# Altium schematic sheet 05 AM572x SYSTEM.SchDoc
size 420 x 297 mm
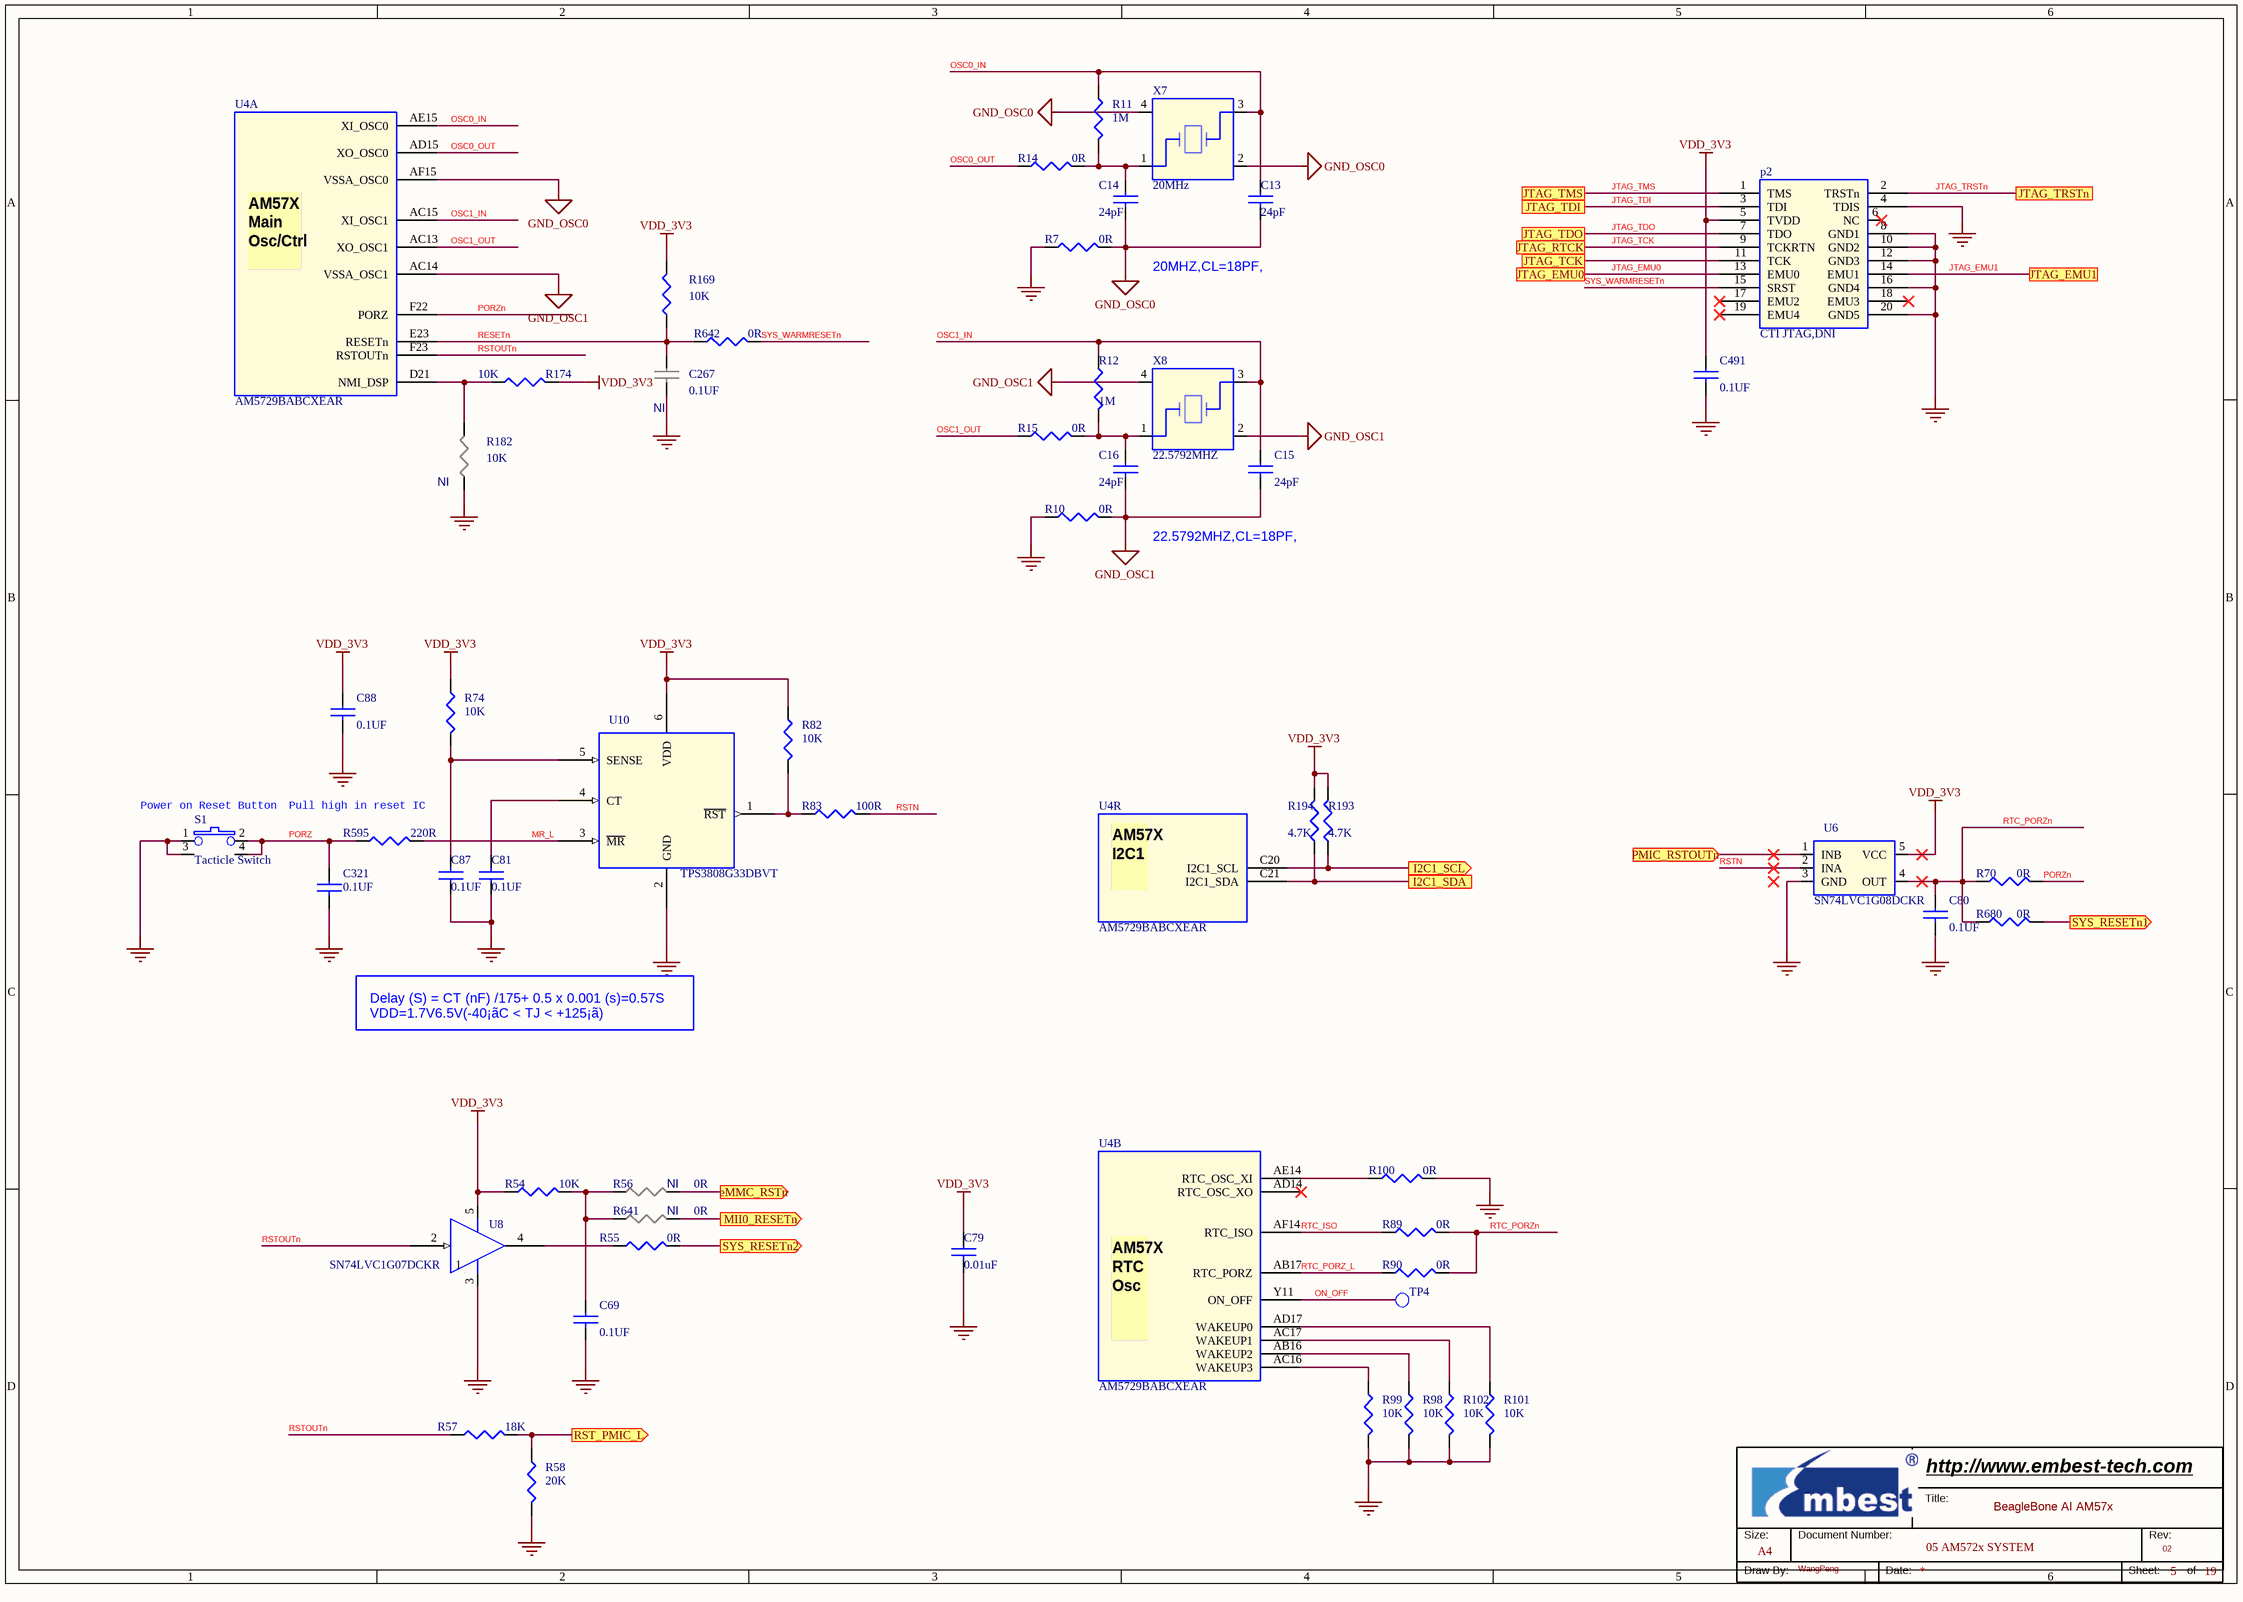
[diagram p0: 05 AM572x SYSTEM.SchDoc]

## Parts
*  Page Count: 19  Page Number: 5  Page Size: A4  Title: BeagleBone AI AM57x  RevCode: 02  Doc: 05 AM572x SYSTEM  Drawing: WangPeng  (hidden comment: Embest Title)  (graphical)
C13  24pF  [C0402]
C14  24pF  [C0402]
C15  24pF  [C0402]
C16  24pF  [C0402]
C69  0.1UF  [C0402]
C79  0.01uF  [C0402]
C80  0.1UF  [C0402]
C81  0.1UF  [C0402]
C87  0.1UF  [C0402]
C88  0.1UF  [C0402]
C267  0.1UF  ASSY: NI  [C0402]
C321  0.1UF  [C0402]
C491  0.1UF  [C0402]
p2  CTI JTAG,DNI  [header10x2]
R7  0R  [R0402]
R10  0R  [R0402]
R11  1M  [R0402]
R12  1M  [R0402]
R14  0R  [R0402]
R15  0R  [R0402]
R54  10K  [R0402]
R55  0R  [R0402]
R56  0R  ASSY: NI  [R0402]
R57  18K  [R0402]
R58  20K  [R0402]
R70  0R  [R0402]
R74  10K  [R0402]
R82  10K  [R0402]
R83  100R  [R0402]
R89  0R  [R0402]
R90  0R  [R0402]
R98  10K  [R0402]
R99  10K  [R0402]
R100  0R  [R0402]
R101  10K  [R0402]
R102  10K  [R0402]
R169  10K  [R0402]
R174  10K  [R0402]
R182  10K  ASSY: NI  [R0402]
R193  4.7K  [R0402]
R194  4.7K  [R0402]
R595  220R  [R0402]
R641  0R  ASSY: NI  [R0402]
R642  0R  [R0402]
R680  0R  [R0402]
S1  Tacticle Switch  [SWS4B46X28]
TP4  NI  [TP1-8040]  (value not drawn)
U4  AM5729BABCXEAR  [BGA23X23-760-117M]  (parts A,B,R of 29)
U6  SN74LVC1G08DCKR  [SC70_5]
U8  SN74LVC1G07DCKR  [SC70_5]
U10  TPS3808G33DBVT  [SOT23_6]
X7  20MHz  [OSCCC250x200x60-4N]
X8  22.5792MHZ  [OSCCC250x200x60-4N]

## Ports
eMMC_RSTn (out), I2C1_SCL (out), I2C1_SDA, JTAG_EMU0, JTAG_EMU1, JTAG_RTCK, JTAG_TCK, JTAG_TDI, JTAG_TDO, JTAG_TMS, JTAG_TRSTn, MII0_RESETn (out), PMIC_RSTOUTn (in), RST_PMIC_L (out), SYS_RESETn1 (out), SYS_RESETn2 (out)

## Nets
GND: C69.2 C79.2 C80.2 C81.1 C87.1 C88.2 C267.2 C321.2 C491.2 p2.4(TDIS) p2.8(GND1) p2.10(GND2) p2.12(GND3) p2.16(GND4) p2.20(GND5) R7.1 R10.1 R58.2 R98.2 R99.2 R100.2 R101.2 R102.2 R182.1 S1.1 S1.3 U6.3(GND) U8.3(GND) U10.2(GND)
GND_OSC0: C13.2 C14.2 R7.2 U4.AF15(VSSA_OSC0) X7.2 X7.4
GND_OSC1: C15.2 C16.2 R10.2 U4.AC14(VSSA_OSC1) X8.2 X8.4
VDD_3V3: C79.1 C88.1 C491.1 p2.5(TVDD) R54.1 R74.1 R82.1 R169.2 R174.2 R193.2 R194.2 U6.5(VCC) U8.5(VCC) U10.6(VDD)
eMMC_RSTn: R56.1 ; port eMMC_RSTn
I2C1_SCL: R193.1 U4.C20(I2C1_SCL) ; port I2C1_SCL
I2C1_SDA: R194.1 U4.C21(I2C1_SDA) ; port I2C1_SDA
JTAG_EMU0: p2.13(EMU0) ; port JTAG_EMU0
JTAG_EMU1: p2.14(EMU1) ; port JTAG_EMU1
JTAG_TCK: p2.9(TCKRTN) ; port JTAG_RTCK
JTAG_TCK: p2.11(TCK) ; port JTAG_TCK  [a separate net that carries the same name]
JTAG_TDI: p2.3(TDI) ; port JTAG_TDI
JTAG_TDO: p2.7(TDO) ; port JTAG_TDO
JTAG_TMS: p2.1(TMS) ; port JTAG_TMS
JTAG_TRSTn: p2.2(TRSTn) ; port JTAG_TRSTn
MII0_RESETn: R641.1 ; port MII0_RESETn
MR_L: R595.2 U10.3(~{MR})
ON_OFF: TP4.1(TP) U4.Y11(ON_OFF)
OSC0_IN: C13.1 R11.1 U4.AE15(XI_OSC0) X7.3
OSC0_OUT: R14.1 U4.AD15(XO_OSC0)
OSC1_IN: C15.1 R12.1 U4.AC15(XI_OSC1) X8.3
OSC1_OUT: R15.1 U4.AC13(XO_OSC1)
PMIC_RSTOUTn: U6.1(INB) ; port PMIC_RSTOUTn
PORZ: C321.1 R595.1 S1.2 S1.4
PORZn: R70.2 U4.F22(PORZ)
RESETn: C267.1 R169.1 R642.1 U4.E23(RESETn)
RST_PMIC_L: R57.2 R58.1 ; port RST_PMIC_L
RSTN: R83.2 U6.2(INA)
RSTOUTn: R57.1 U4.F23(RSTOUTn) U8.2(A)
RTC_ISO: R89.1 U4.AF14(RTC_ISO)
RTC_PORZ_L: R90.1 U4.AB17(RTC_PORZ)
RTC_PORZn: C80.1 R70.1 R89.2 R90.2 R680.1 U6.4(OUT)
SYS_RESETn1: R680.2 ; port SYS_RESETn1
SYS_RESETn2: R55.2 ; port SYS_RESETn2
SYS_WARMRESETn: p2.15(SRST) R642.2
NetC14_1: C14.1 R11.2 R14.2 X7.1
NetC16_1: C16.1 R12.2 R15.2 X8.1
NetC69_1: C69.1 R54.2 R56.2 R641.2
NetC81_2: C81.2 U10.4(CT)
NetC87_2: C87.2 R74.2 U10.5(SENSE)
NetR55_1: R55.1 U8.4(Y)
NetR82_2: R82.2 R83.1 U10.1(~{RST})
NetR98_1: R98.1 U4.AB16(WAKEUP2)
NetR99_1: R99.1 U4.AC16(WAKEUP3)
NetR100_1: R100.1 U4.AE14(RTC_OSC_XI)
NetR101_1: R101.1 U4.AD17(WAKEUP0)
NetR102_1: R102.1 U4.AC17(WAKEUP1)
NetR174_1: R174.1 R182.2 U4.D21(NMI_DSP)

Not connected (* = marked no-connect by the designer): p2 6(NC)* 17(EMU2)* 18(EMU3)* 19(EMU4)*; U4 AD14(RTC_OSC_XO)*; U8 1(NC)

## Notes on the sheet
- 20MHZ,CL=18PF,
- 22.5792MHZ,CL=18PF,
- (near S1) Power on Reset Button
- (near R595) Pull high in reset IC
- Delay (S) = CT (nF) /175+ 0.5 x 0.001 (s)=0.57S
  VDD=1.7V6.5V(-40¡ãC < TJ < +125¡ã)
- (in symbol AM57X, part A) AM57X / Main / Osc/Ctrl /
- (in symbol AM57X, part B) AM57X RTC / Osc /
- (in symbol AM57X, part R) AM57X / I2C1 /
- (in symbol Embest Title) Title:; Size:; Document Number:; Rev:; Draw By:; Date:; Sheet:; of

## Library data of the parts
C13 C14 = C: CAP,24pF,+/-5%,C0G,50V,SMD0402; Manufacturer: Murata; Manufacturer Part Number: GRM1555C1H240JA01D; Embest PN: 1004001100239; Part Type: Ceramic Capacitor
C15 C16 = C: CAP,24pF,+/-5%,C0G,50V,SMD0402; Manufacturer Part Number: GRM1555C1H240JA01D; Manufacturer: Murata; Embest PN: 1004001100239; Part Type: Ceramic Capacitor
C69 C87 C88 C321 = C: CAP,100NF,+/-10%,X7R,16V,SMD0402; Manufacturer Part Number: GRM155R71C104KA88D; Manufacturer: Murata; Embest PN: 1004001100047; Datasheet: Y:\ÐÂK3ÏµÍ³ÎïÁÏdatasheet\[1003_1004]capacitor-resistor µçÈÝ¡¢µç×è\1004001100047-GRM155R71C104KA88D.pdf; Part Type: Ceramic Capacitor
C79 = C: CAP,10NF,+/-10%,X7R,16V,SMD0402; Manufacturer Part Number: GRM155R71C103KA01D; Manufacturer: MURATA; Embest PN: 1004001100039; Part Type: Ceramic Capacitor
C80 C81 C267 C491 = C: CAP,100NF,+/-10%,X7R,16V,SMD0402; Manufacturer: Murata; Manufacturer Part Number: GRM155R71C104KA88D; Embest PN: 1004001100047; Part Type: Ceramic Capacitor; Datasheet: Y:\ÐÂK3ÏµÍ³ÎïÁÏdatasheet\[1003_1004]capacitor-resistor µçÈÝ¡¢µç×è\1004001100047-GRM155R71C104KA88D.pdf
p2 = HDR_10x2_CJTAG_0: Dual Line Header 10x2pin Tin; TIIntPartnumber: 2H0039; MfrNum: FTR-110-03-G-D-06; PartName: HEADERCTIJTAG10x2Pin; PCB Footprint: SMD10x2Pin0.050in; Cost10K: 0.97; Cost100: 1.20; Vendor: Samtec; Mfr: Samtec
R7 R10 R14 R15 R55 R56 R70 R100 R642 = R: RES,0R,+/-5%,1/16W,SMD0402; Manufacturer Part Number: RC0402JR-070RL; Manufacturer: YAGEO; Embest PN: 1003001100001; Part Type: Thick film Resistor
R11 = R: RES,1M,+/-5%,1/16W,SMD0402; Manufacturer: YAGEO; Manufacturer Part Number: RC0402JR-071ML; Embest PN: 1003001100154; Part Type: Thick film Resistor
R12 = R: RES,1M,+/-5%,1/16W,SMD0402; Manufacturer Part Number: RC0402JR-071ML; Manufacturer: YAGEO; Embest PN: 1003001100154; Part Type: Thick film Resistor
R54 R74 R82 R98 R99 R101 R102 R169 R174 R182 = R: RES,10K,+/-5%,1/16W,SMD0402; Manufacturer Part Number: RC0402JR-0710KL; Manufacturer: YAGEO; Embest PN: 1003001100072; Part Type: Thick film Resistor
R57 = R: RES,18K,+/-1%,1/16W,SMD0402; Manufacturer: YAGEO; Manufacturer Part Number: RC0402FR-0718KL; Embest PN: 1003001100645; Part Type: Thick film Resistor
R58 = R: RES,20K,+/-1%,1/16W,SMD0402; Manufacturer: YAGEO; Manufacturer Part Number: RC0402FR-0720KL; Embest PN: 1003001100083; Part Type: Thick film Resistor
R83 = R: RES,100R,+/-5%,1/16W,SMD0402; Manufacturer: YAGEO; Manufacturer Part Number: RC0402JR-07100RL; Embest PN: 1003001100020; Part Type: Thick film Resistor
R89 R90 R641 R680 = R: RES,0R,+/-5%,1/16W,SMD0402; Manufacturer: YAGEO; Manufacturer Part Number: RC0402JR-070RL; Embest PN: 1003001100001; Part Type: Thick film Resistor
R193 R194 = R: RES,4K7,+/-5%,1/16W,SMD0402; Manufacturer: YAGEO; Manufacturer Part Number: RC0402JR-074K7L; Embest PN: 1003001100057; Part Type: Thick film Resistor
R595 = R: RES,220R,+/-5%,1/16W,SMD0402; Manufacturer Part Number: RC0402JR-07220RL; Manufacturer: YAGEO; Embest PN: 1003001100025; Part Type: Thick film Resistor
S1 = PSW4: Switch,Tactile,300gf+/-50gf,black housing,black plunger,4.6*2.8*1.9MM,SMD; Manufacturer Part Number: KMR231GLFS; Manufacturer: C&K; Embest PN: 1010001100030; Datasheet: Y:\ÐÂK3ÏµÍ³ÎïÁÏdatasheet\[1010]switches ¿ª¹Ø°´¼ü\1010001100030_KMR231GLFS_C&K.pdf; Part Type: TACT
TP4 = TEST POINT: Test point,DIA 30mil; PCB Footprint: TP30; Embest PN: PN008; Part Type: TP
U4 = AM57X: IC ARM Dual Cortex-A15 Microprocessor FCBGA(ABC)-760 SMD JEDEC TRAY; Vendor: TI; Embest PN: 1002001100053; Status: BeagleBone AI; Manufacturer Part Number: AM5729BABCXEAR; Manufacturer: TI; Part Type: MPU
U6 = SN74LVC1G08DCKR: IC,SINGLE 2-INPUT POSITIVE-AND GATE,SN74LVC1G08DCKR,SOT-353,SMD; Manufacturer: TI; Embest PN: 1002008100067; Datasheet: Y:\ÐÂK3ÏµÍ³ÎïÁÏdatasheet\[1002]IC ¼¯³ÉµçÂ·\1002008100067-sn74lvc1g08.pdf; Status: AVL; Manufacturer Part Number: SN74LVC1G08DCKR; Part Type: Logic
U8 = SN74LVC1G07DCKR: IC,SINGLE BUFFER/DRIVER WITH OPEN-DRAIN OUTPUT,SN74LVC1G07DCKR,SC-70,SMD; Manufacturer: TI; Embest PN: 1002008100087; Part Type: Logic; Manufacturer Part Number: SN74LVC1G07DCKR; Datasheet: Y:\ÐÂK3ÏµÍ³ÎïÁÏdatasheet\[1002]IC ¼¯³ÉµçÂ·\1002008100087 sn74lvc1g07 ti.pdf
U10 = TPS3808G: IC,Low Quiescent Current, Programmable-Delay / Supervisory Circuit,TPS3808G33DBVT,SOT-23,SMD; Manufacturer: TI; Embest PN: 1002009100021; Part Type: Monitor; Manufacturer Part Number: TPS3808G33DBVT; Datasheet: Y:\ÐÂK3ÏµÍ³ÎïÁÏdatasheet\[1002]IC ¼¯³ÉµçÂ·\1002009100021_tps3808g01_TI.pdf
X7 = X4: Crystal,5ZAA20000181TFA2Q3,20MHz,+/-10PPM,18PF,2520-4 pads,SMD; Manufacturer: INTERQUIP; Rating: 10PPM; Embest PN: 1008002100253; Datasheet: Y:\ÐÂK3ÏµÍ³ÎïÁÏdatasheet\[1008]crystal ¾§Ìå\1008002100253 5ZAA20000181TFA2Q3¹æ¸ñÊé.pdf; Status: Hamster AM572x; Manufacturer Part Number: 5ZAA20000181TFA2Q3; Part Type: Crystal
X8 = X4: Crystal,5ZAA22579182TFA0Q3,22.5792MHz,+/-20PPM,18PF,2520-4 pads,SMD; Manufacturer: INTERQUIP; Embest PN: 1008002100254; Rating: 20PPM; Part Type: Crystal; Manufacturer Part Number: 5ZAA22579182TFA0Q3; Status: Hamster AM572x; Datasheet: Y:\ÐÂK3ÏµÍ³ÎïÁÏdatasheet\[1008]crystal ¾§Ìå\1008002100254 5ZAA22579182TFA0Q3¹æ¸ñÊé.pdf
* = Embest Title: Page Create Date: May 29, 2006; WebSite: http://www.embest-tech.com; Company: Embest; Page Modify Date: *